# EAGLE schematic RAFT_DuckLink_3V3_Reg (EAGLE 9.5.2)
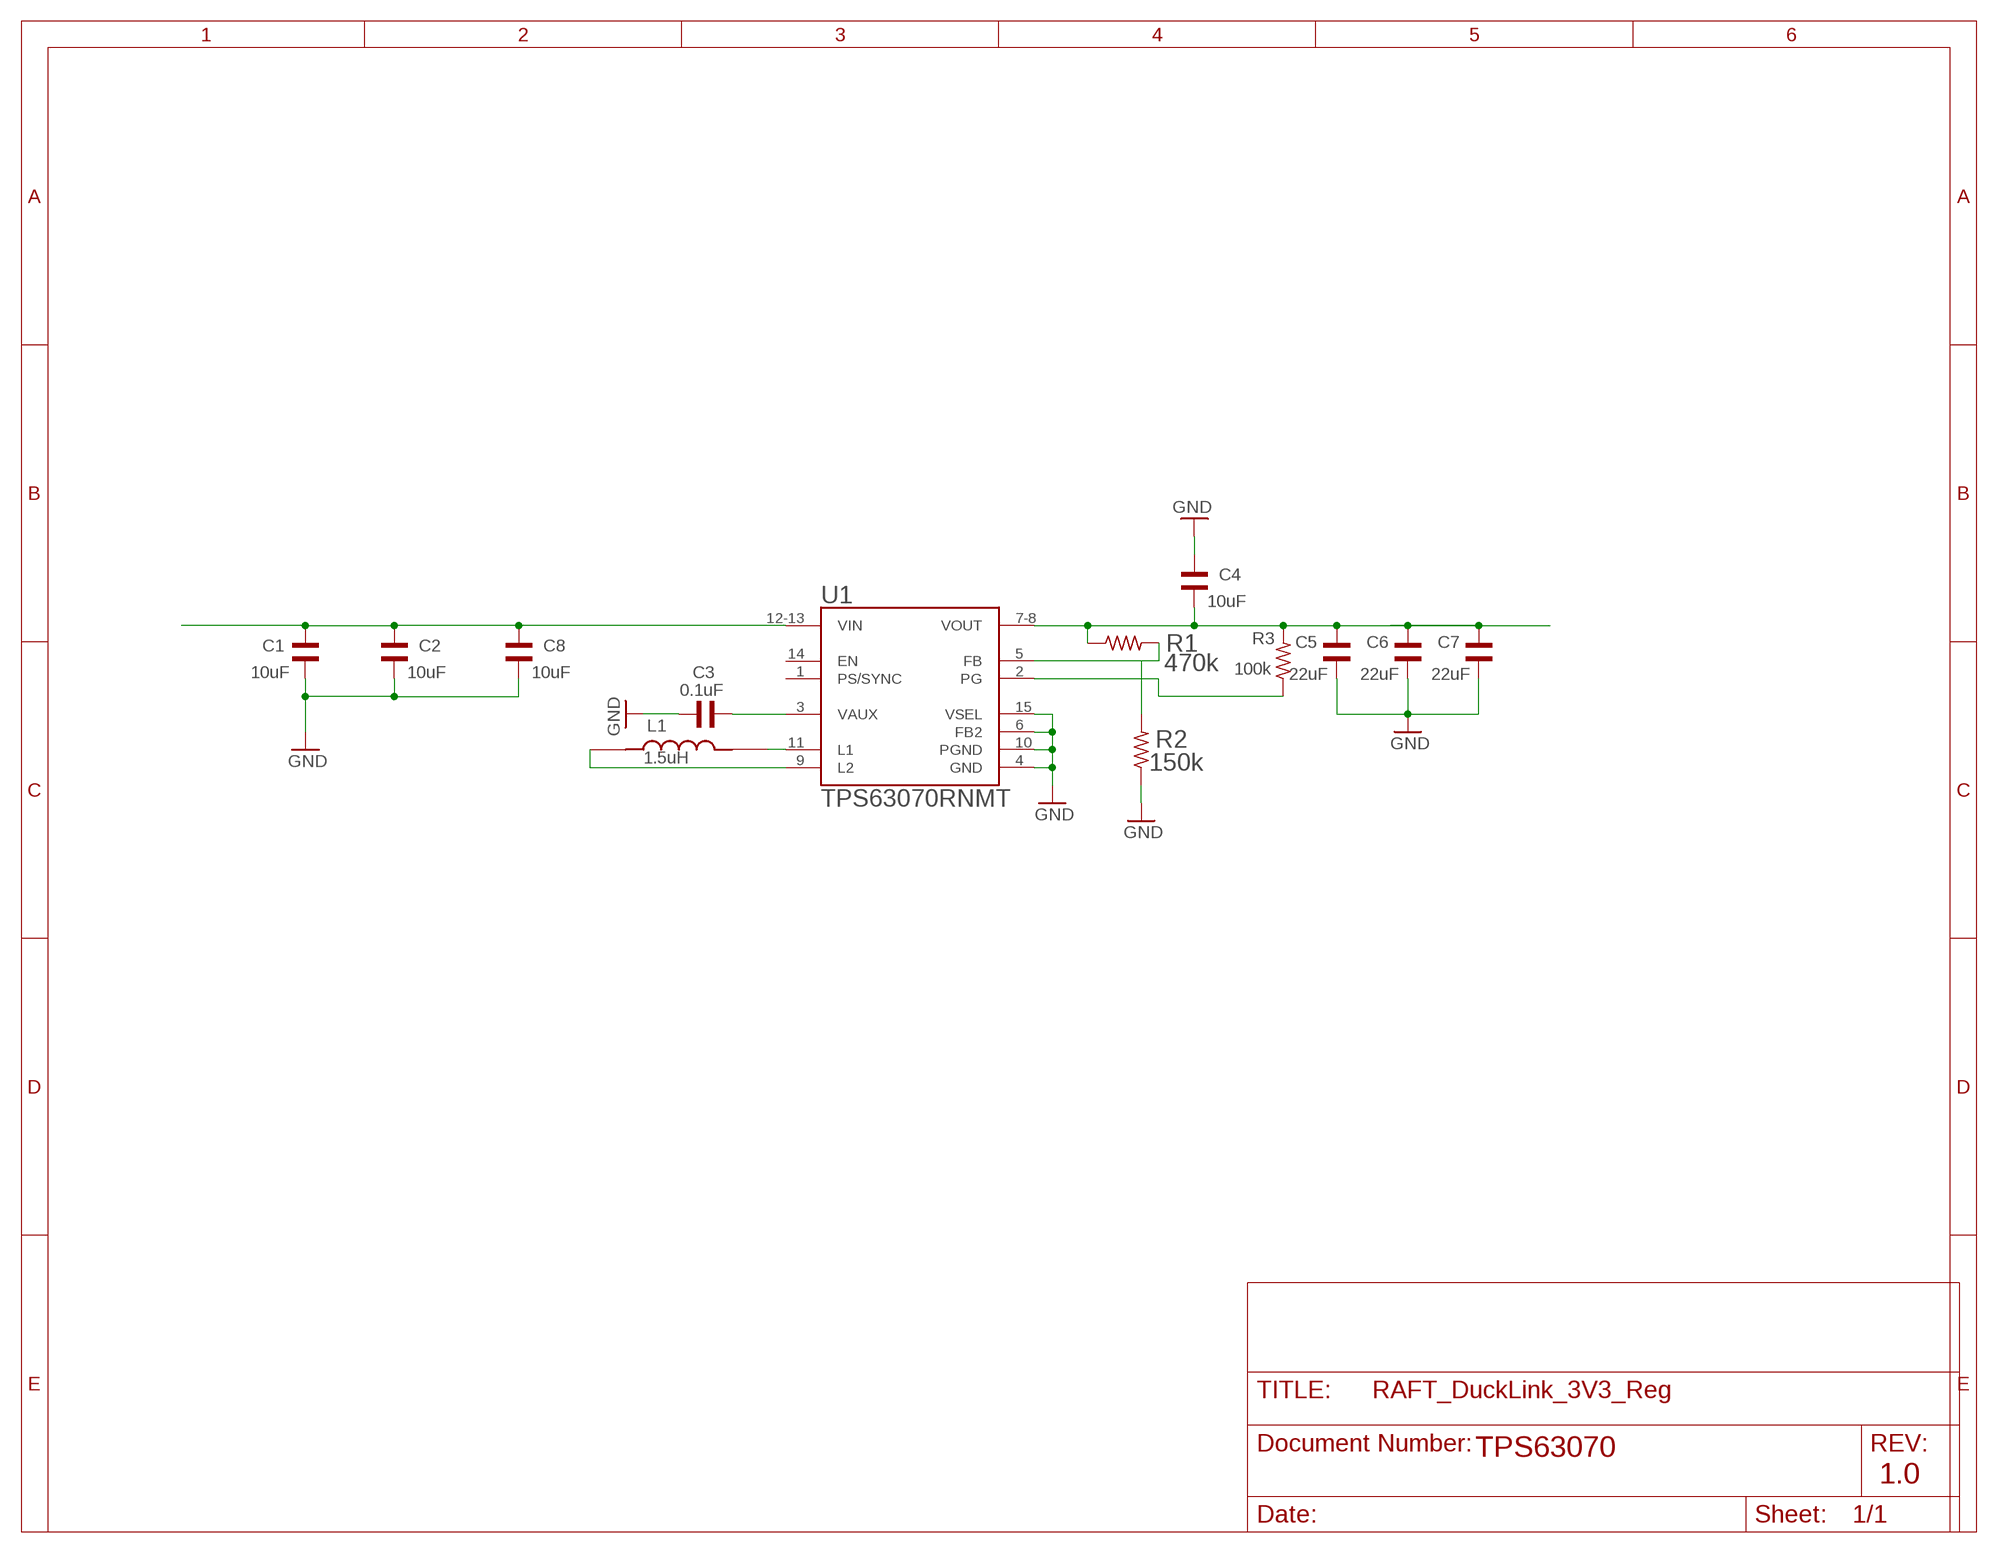
[diagram p0: schematic, sheet 1]

## Parts
C1  10uF  GRM155C80J106ME11D  [CAPC1005X70N]
C2  10uF  GRM155C80J106ME11D  [CAPC1005X70N]
C3  0.1uF  GRM155R71C104KA88D  [CAPC1005X55N]
C4  10uF  GRM155C80J106ME11D  [CAPC1005X70N]
C5  22uF  CL05A226MQ5N6J8  [CAPC1005X55N]
C6  22uF  CL05A226MQ5N6J8  [CAPC1005X55N]
C7  22uF  CL05A226MQ5N6J8  [CAPC1005X55N]
C8  10uF  GRM155C80J106ME11D  [CAPC1005X70N]
L1  1.5uH  XFL4020-152MEB  [IND_XFL4020-152MEB]
R1  470k  ERJ-PA2F4703X  [RESC1005X40N]
R2  150k  ERJ-2GEJ154X  [RESC1005X40N]
R3  100k  CRCW0402100KFKED  [RESC1005X40N]
U1  TPS63070RNMT  [QFN50P250X300X100-15N]

## Nets
GND: C1.1 C2.1 C3.1 C4.2 C5.1 C6.1 C7.1 C8.1 R2.1 U1.4(GND) U1.6(FB2) U1.10(PGND) U1.15(VSEL)
N$1: R1.2 R2.2 U1.5(FB)
N$3: R3.1 U1.2(PG)
N$4: C3.2 U1.3(VAUX)
N$6: C4.1 C5.2 C6.2 C7.2 R1.1 R3.2 U1.7-8(VOUT)
N$8: L1.2 U1.11(L1)
N$9: L1.1 U1.9(L2)
N$10: C1.2 C2.2 C8.2 U1.12-13(VIN)
Unconnected: U1.1(PS/SYNC) U1.14(EN)

## Notes on the sheet
- TPS63070
- 1.0

## Library data of the parts
C1 C2 C4 C8 = GRM155C80J106ME11D:GRM155C80J106ME11D: 10UF 6.3V 20% 0402; AVAILABILITY: Unavailable; DESCRIPTION: 10µF ±20% 6.3V Ceramic Capacitor X6S 0402 _1005 Metric_; MF: Murata Electronics; MP: GRM155C80J106ME11D; PACKAGE: 1005 Murata; PRICE: None
C3 = GRM155R71C104KA88D:GRM155R71C104KA88D: CAP CER 0.1UF 16V 10% X7R 0402; AVAILABILITY: Unavailable; DESCRIPTION: 0.1µF ±10% 16V Ceramic Capacitor X7R 0402 _1005 Metric_; MF: Murata; MP: GRM155R71C104KA88D; PACKAGE: 1005 Taiyo Yuden; PRICE: None
C5-C7 = CL05A226MQ5N6J8:CL05A226MQ5N6J8: Cap Ceramic 22uF 6.3V X5R 20% Pad SMD 0402 85C T/R; DESCRIPTION: 22µF ±20% 6.3V Ceramic Capacitor X5R 0402 _1005 Metric_; DIGI-KEY_PART_NUMBER: 1276-7090-1-ND; DIGI-KEY_PURCHASE_URL: https://www.digikey.com/product-detail/en/samsung-electro-mechanics/CL05A226MQ5N6J8/1276-7090-1-ND/7320732?utm_source=snapeda&utm_medium=aggregator&utm_campaign=symbol; MF: Samsung Electro-Mechanics; MP: CL05A226MQ5N6J8; PACKAGE: 0402 Samsung Electro-Mechanics
L1 = XFL4020-152MEB:XFL4020-152MEB: Power inductor, shielded, 20% tol, SMT, RoHS, halogen free; AVAILABILITY: Unavailable; DESCRIPTION: Power inductor, shielded, 20% tol, SMT, RoHS, halogen free; MF: Coilcraft; MP: XFL4020-152MEB; PACKAGE: None; PRICE: None
R1 = ERJ-PA2F4703X:ERJ-PA2F4703X: RES SMD 470K OHM 1% 1/5W 0402; AVAILABILITY: Unavailable; DESCRIPTION: Res Thick Film 0402 470K Ohm 1% 0.2W_1/5W_ ±100ppm/°C Pad SMD Automotive T/R; MF: Panasonic; MP: ERJ-PA2F4703X; PACKAGE: 1005 Panasonic Electronic Components; PRICE: None
R2 = ERJ-2GEJ154X:ERJ-2GEJ154X: Surface Mount Thick Film Resistor, AEC-Q200 ERJ Series, 150 kohm, 100 mW, - 5%, 50 V; AVAILABILITY: Unavailable; DESCRIPTION: Res Thick Film 0402 150K Ohm 5% 0.1W_1/10W_ ?200ppm/C Molded SMD Automotive Punched T/R; MF: Panasonic Electronic; MP: ERJ-2GEJ154X; PACKAGE: 1005 Panasonic Electronic Components; PRICE: None
R3 = CRCW0402100KFKED:CRCW0402100KFKED
U1 = TPS63070RNMT:TPS63070RNMT: Wide Input Voltage (2V-16V) Buck-Boost Converter 15-VQFN-HR; AVAILABILITY: Unavailable; DESCRIPTION: Conv DC-DC 2V to 16V Step Down/Step Up Single-Out 2.5V to 9V 2A 15-Pin VQFN-HR T/R; MF: Texas Instruments; MP: TPS63070RNMT; PACKAGE: VQFN-15 Texas Instruments; PRICE: None